# EAGLE design IO4-IR-Detector-Active-Fingers (EAGLE 7.7.0)
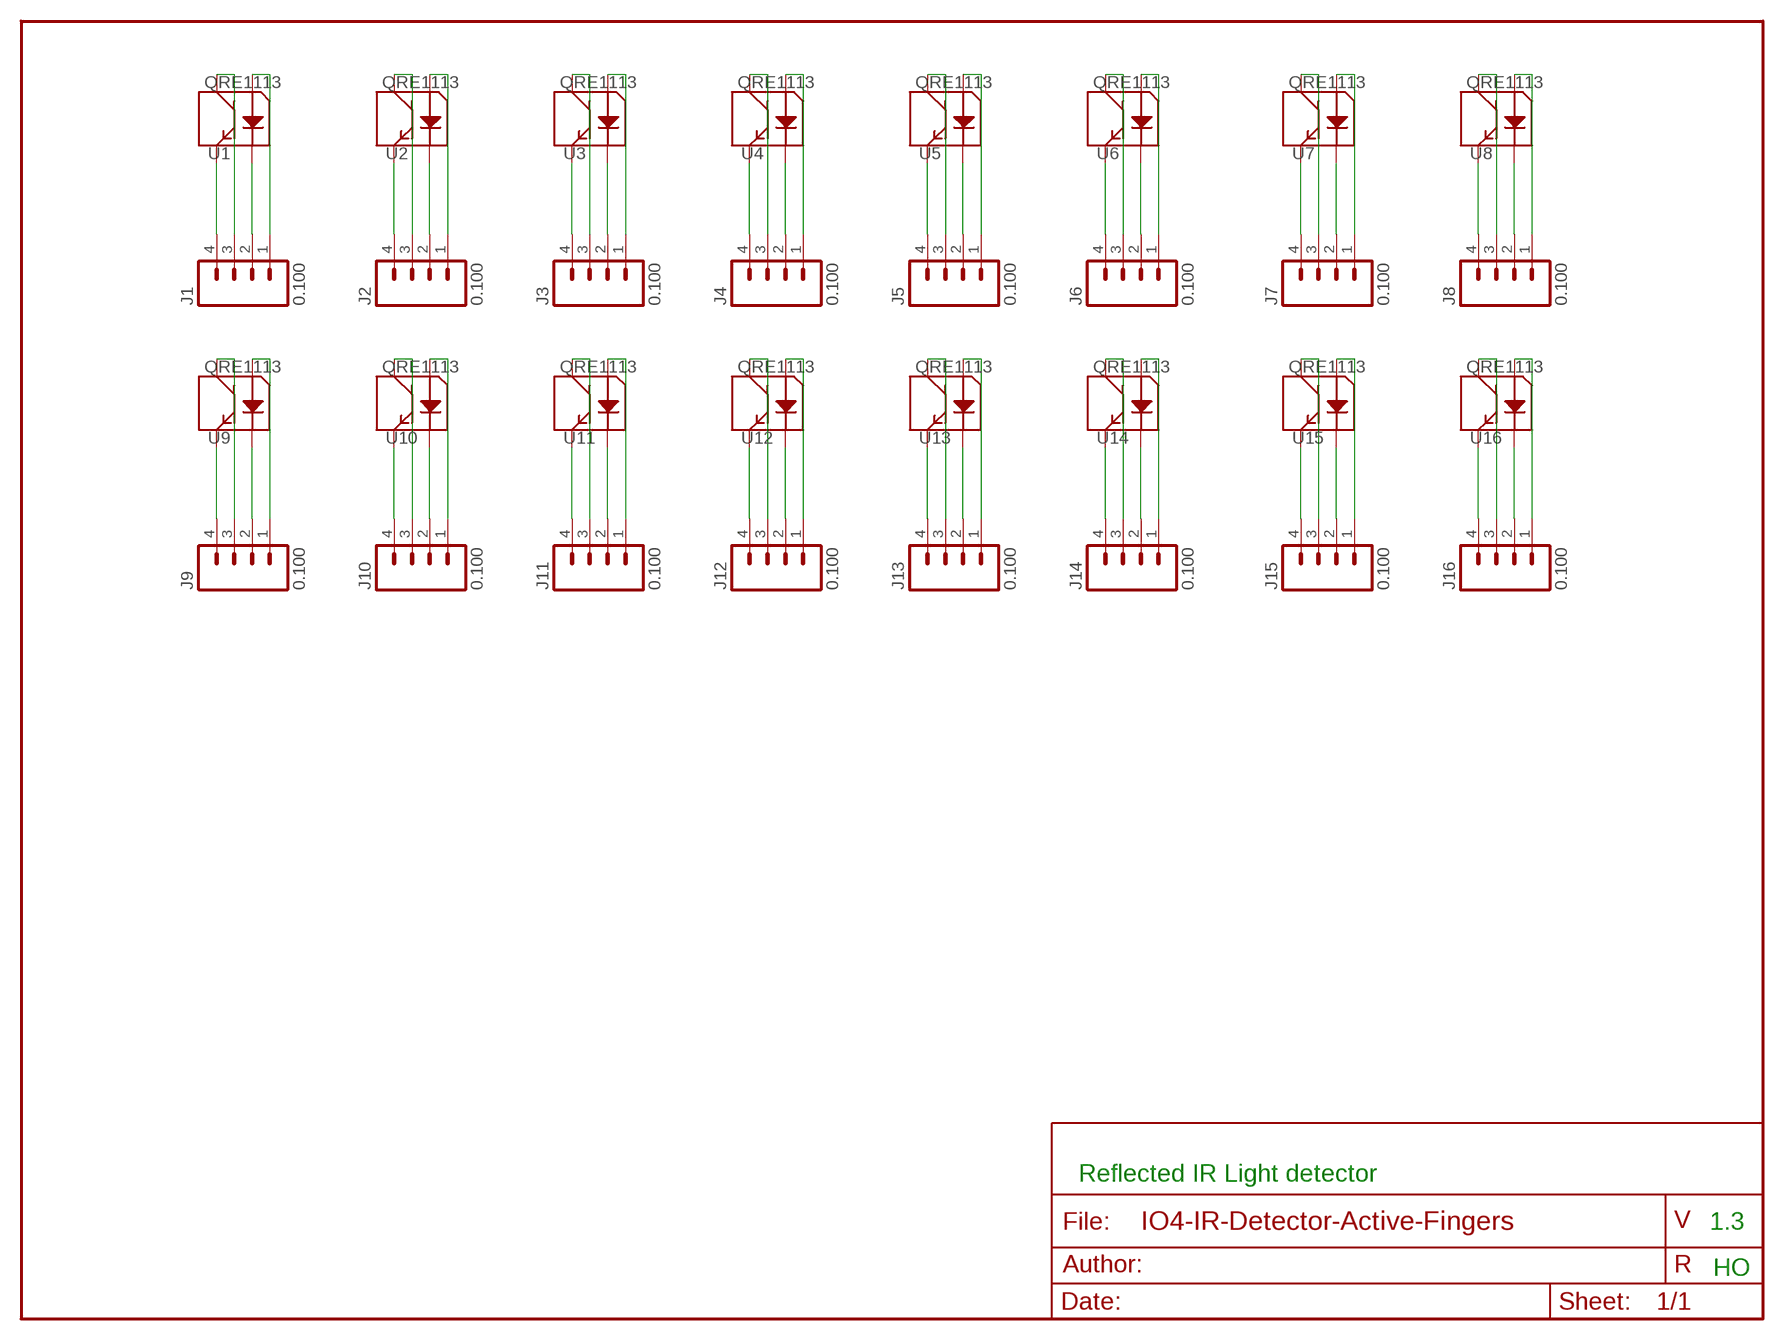
[diagram p0: schematic, sheet 1]

## Parts
J1  0.100  CONNECTOR-M04LOCK  [1X04_LOCK]
J2  0.100  CONNECTOR-M04LOCK  [1X04_LOCK]
J3  0.100  CONNECTOR-M04LOCK  [1X04_LOCK]
J4  0.100  CONNECTOR-M04LOCK  [1X04_LOCK]
J5  0.100  CONNECTOR-M04LOCK  [1X04_LOCK]
J6  0.100  CONNECTOR-M04LOCK  [1X04_LOCK]
J7  0.100  CONNECTOR-M04LOCK  [1X04_LOCK]
J8  0.100  CONNECTOR-M04LOCK  [1X04_LOCK]
J9  0.100  CONNECTOR-M04LOCK  [1X04_LOCK]
J10  0.100  CONNECTOR-M04LOCK  [1X04_LOCK]
J11  0.100  CONNECTOR-M04LOCK  [1X04_LOCK]
J12  0.100  CONNECTOR-M04LOCK  [1X04_LOCK]
J13  0.100  CONNECTOR-M04LOCK  [1X04_LOCK]
J14  0.100  CONNECTOR-M04LOCK  [1X04_LOCK]
J15  0.100  CONNECTOR-M04LOCK  [1X04_LOCK]
J16  0.100  CONNECTOR-M04LOCK  [1X04_LOCK]
U1  QRE1113  [QRE1113]
U2  QRE1113  [QRE1113]
U3  QRE1113  [QRE1113]
U4  QRE1113  [QRE1113]
U5  QRE1113  [QRE1113]
U6  QRE1113  [QRE1113]
U7  QRE1113  [QRE1113]
U8  QRE1113  [QRE1113]
U9  QRE1113  [QRE1113]
U10  QRE1113  [QRE1113]
U11  QRE1113  [QRE1113]
U12  QRE1113  [QRE1113]
U13  QRE1113  [QRE1113]
U14  QRE1113  [QRE1113]
U15  QRE1113  [QRE1113]
U16  QRE1113  [QRE1113]

## Nets
N$1: J1.4 U1.4(E)
N$2: J1.2 U1.2(K)
N$3: J1.1 U1.1(A)
N$4: J4.4 U4.4(E)
N$5: J4.2 U4.2(K)
N$6: J4.1 U4.1(A)
N$7: J1.3 U1.3(C)
N$8: J6.1 U6.1(A)
N$9: J7.1 U7.1(A)
N$10: J8.1 U8.1(A)
N$11: J9.1 U9.1(A)
N$12: J10.1 U10.1(A)
N$13: J11.1 U11.1(A)
N$14: J12.1 U12.1(A)
N$15: J13.1 U13.1(A)
N$16: J14.1 U14.1(A)
N$17: J15.1 U15.1(A)
N$18: J16.1 U16.1(A)
N$19: J2.4 U2.4(E)
N$20: J2.2 U2.2(K)
N$21: J2.1 U2.1(A)
N$22: J3.4 U3.4(E)
N$23: J3.2 U3.2(K)
N$24: J3.1 U3.1(A)
N$25: J2.3 U2.3(C)
N$26: J5.4 U5.4(E)
N$27: J5.2 U5.2(K)
N$28: J5.1 U5.1(A)
N$29: J6.4 U6.4(E)
N$30: J6.2 U6.2(K)
N$31: J3.3 U3.3(C)
N$32: J7.4 U7.4(E)
N$33: J7.2 U7.2(K)
N$34: J4.3 U4.3(C)
N$35: J8.4 U8.4(E)
N$36: J8.2 U8.2(K)
N$37: J5.3 U5.3(C)
N$38: J9.4 U9.4(E)
N$39: J9.2 U9.2(K)
N$40: J7.3 U7.3(C)
N$41: J8.3 U8.3(C)
N$42: J16.3 U16.3(C)
N$43: J15.3 U15.3(C)
N$44: J14.3 U14.3(C)
N$45: J10.4 U10.4(E)
N$46: J10.2 U10.2(K)
N$47: J13.3 U13.3(C)
N$48: J11.4 U11.4(E)
N$49: J11.2 U11.2(K)
N$50: J12.3 U12.3(C)
N$51: J12.4 U12.4(E)
N$52: J12.2 U12.2(K)
N$53: J13.4 U13.4(E)
N$54: J13.2 U13.2(K)
N$55: J11.3 U11.3(C)
N$56: J14.4 U14.4(E)
N$57: J14.2 U14.2(K)
N$58: J15.4 U15.4(E)
N$59: J15.2 U15.2(K)
N$60: J16.4 U16.4(E)
N$61: J16.2 U16.2(K)
N$62: J10.3 U10.3(C)
N$63: J9.3 U9.3(C)
N$64: J6.3 U6.3(C)

## Notes on the sheet
- Reflected IR Light detector
- 1.3
- HO

## Library data of the parts
J1-J16 = SPCoast:CONNECTOR-M04: Header 4 Standard 4-pin 0.1" header. Use with straight break away headers (SKU : PRT-00116), right angle break away headers (PRT-00553), swiss pins (PRT-00743), machine pins (PRT-00117), and female headers (PRT-00115). Molex polarized connector foot print use with SKU : PRT-08231 with associated crimp pins and housings. 1MM SMD Version SKU: PRT-10208
U1-U16 = SPCoast:QRE1113: Reflective object sensor; PROD_ID: IC-09357

## Board
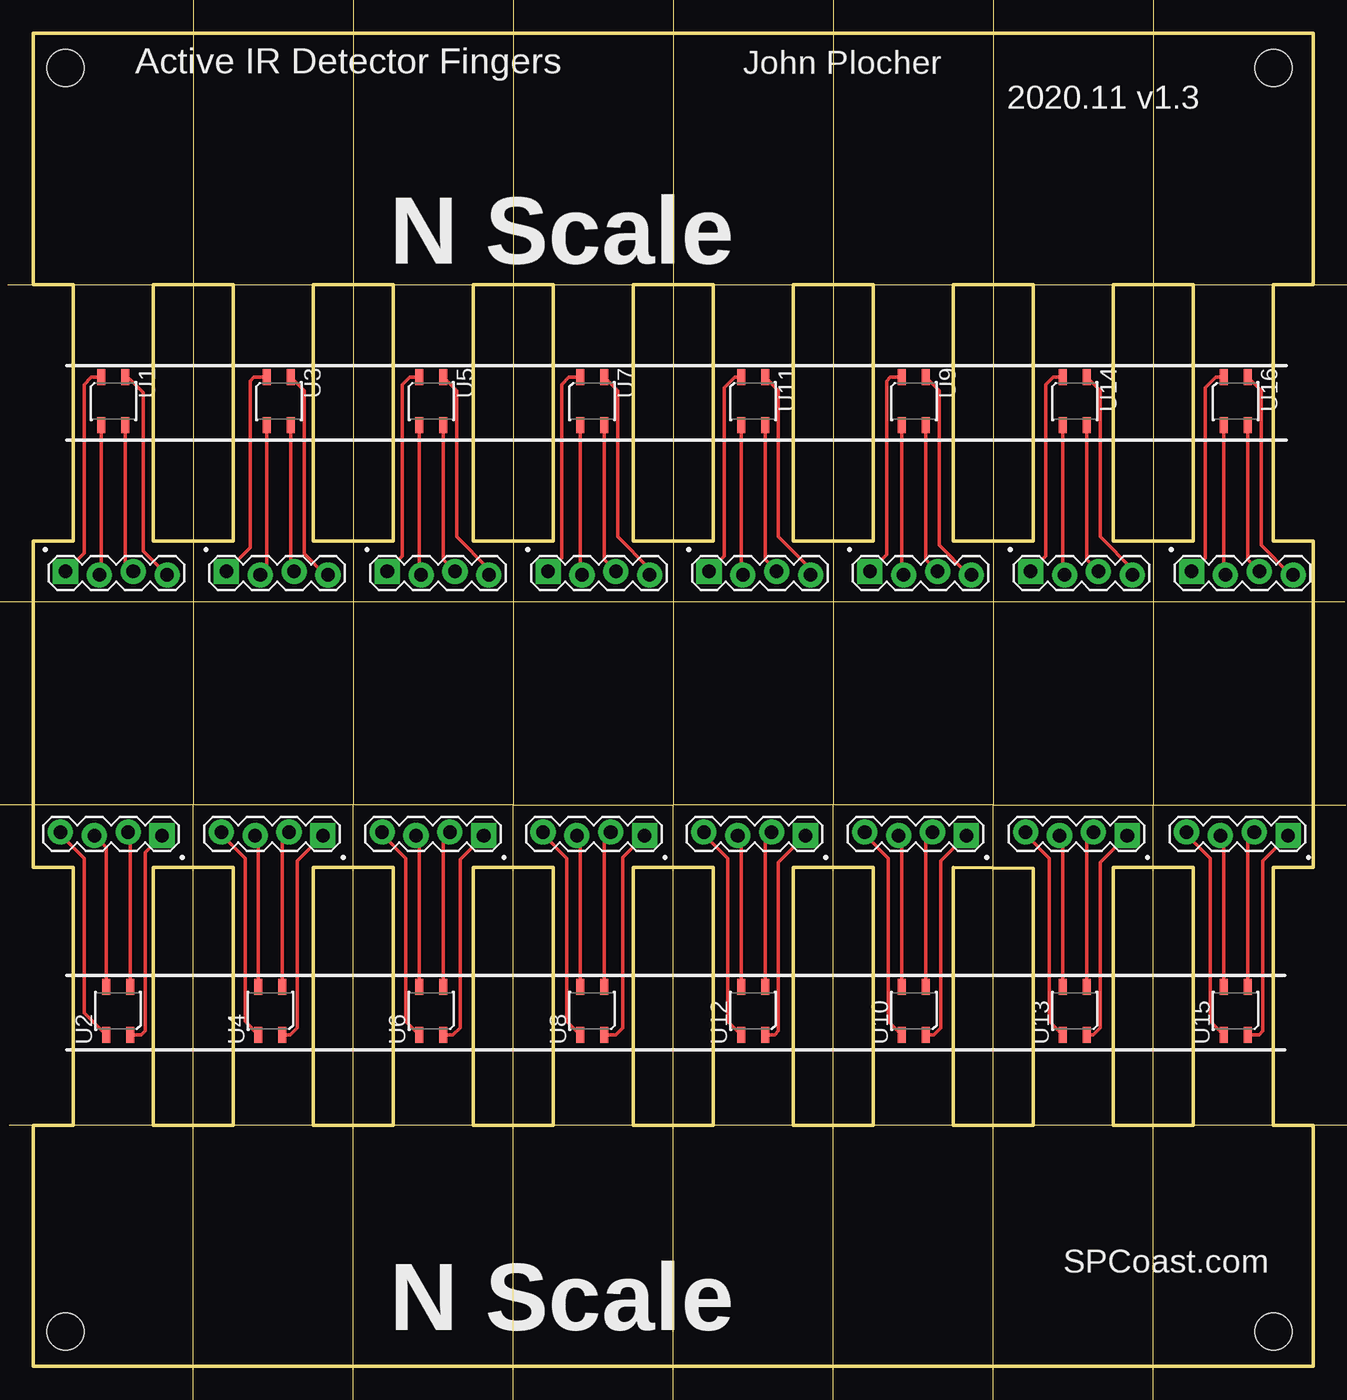
[diagram p1: board, top side]
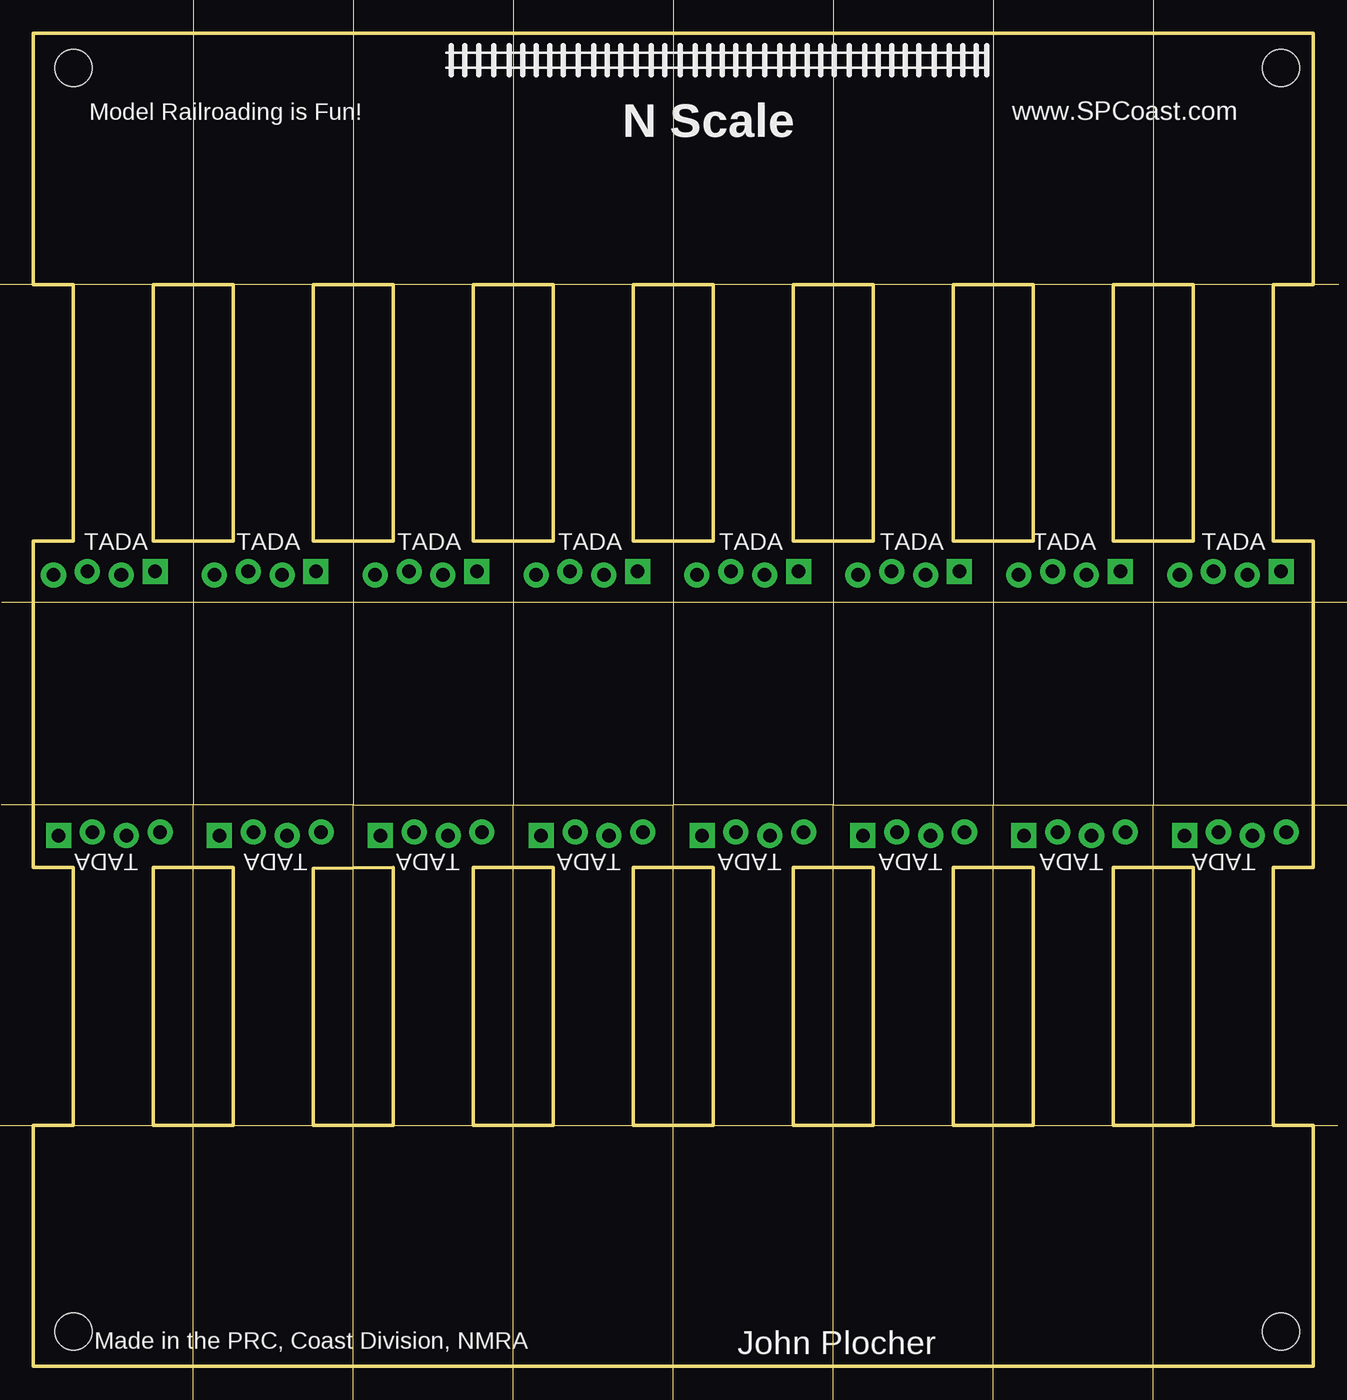
[diagram p2: board, bottom side, seen from below]

Size 96 x 100 mm. Coordinates in mm from the lower left corner, seen from the top.
Outline: 9,61.91 9,81.15 15,81.15 15,61.91 9,61.91
Outline: 3,81.15 3,61.91 0,61.91 0,37.4 3,37.4 3,18.09 0,18.09 0,0 96,0 96,18.09 93,18.09 93,37.4 96,37.4 96,61.91 93,61.91 93,81.15 96,81.15 96,100 0,100 0,81.15 3,81.15
Outline: 9,18.09 9,37.4 15,37.4 15,18.09 9,18.09
Outline: 21,61.91 21,81.15 27,81.15 27,61.91 21,61.91
Outline: 21,18.09 21,37.4 27,37.4 27,18.09 21,18.09
Outline: 33,61.91 33,81.15 39,81.15 39,61.91 33,61.91
Outline: 33,18.09 33,37.4 39,37.4 39,18.09 33,18.09
Outline: 45,18.09 45,37.4 51,37.4 51,18.09 45,18.09
Outline: 45,61.91 45,81.15 51,81.15 51,61.91 45,61.91
Outline: 69,61.91 69,81.15 75,81.15 75,61.91 69,61.91
Outline: 63,81.15 63,61.91 57,61.91 57,81.15 63,81.15
Outline: 63,37.4 63,18.09 57,18.09 57,37.4 63,37.4
Outline: 69,18.09 69,37.4 75,37.34 75,18.09 69,18.09
Outline: 81,18.09 81,37.4 87,37.4 87,18.09 81,18.09
Outline: 81,61.91 81,81.15 87,81.15 87,61.91 81,61.91
Copper layers (1*16): Top 0.035mm / dielectric 1.5mm / Bottom 0.035mm
Design rules "default *": minimum track width 10mil, minimum drill 0.6mm, track to track 8mil, track to pad 8mil, pad to pad 8mil, via to via 8mil, smd to smd 8mil, copper to edge 8mil, drill to drill 8mil, minimum pad ring 10mil, minimum via ring 8mil, stop-mask expansion 4mil, vias tented up to drill 0mil, thermal gap 10mil
Holes 2.8 mm at 2.41,97.41 93,97.41 93,2.59 2.41,2.59
Milling: 25 lines

### Footprints (pad centres in the part's own frame; a part is rotated, then mirrored left to right if it is on the bottom)
1X04_LOCK = drill 1.016 pad 1.88 square: 1 0,0.127 | drill 1.016 pad 1.88: 2 2.54,-0.127; 3 5.08,0.127; 4 7.62,-0.127
QRE1113 = smd 1.2 x 0.6: 1 -1.8,-0.9; 2 1.8,-0.9; 3 1.8,0.9; 4 -1.8,0.9

### Placement (x,y rotation side)
J1  2.41,59.5 0 top
J2  9.65,39.94 180 top
J3  14.48,59.5 0 top
J4  21.72,39.94 180 top
J5  26.54,59.5 0 top
J6  33.78,39.94 180 top
J7  38.61,59.5 0 top
J8  45.85,39.94 180 top
J9  62.74,59.5 0 top
J10  69.98,39.94 180 top
J11  50.67,59.5 0 top
J12  57.91,39.94 180 top
J13  82.04,39.94 180 top
J14  74.8,59.5 0 top
J15  94.11,39.94 180 top
J16  86.87,59.5 0 top
U1  6,72.39 270 top
U2  6.35,26.67 90 top
U3  18.41,72.39 270 top
U4  17.78,26.67 90 top
U5  29.84,72.39 270 top
U6  29.84,26.67 90 top
U7  41.91,72.39 270 top
U8  41.91,26.67 90 top
U9  66.04,72.39 270 top
U10  66.04,26.67 90 top
U11  53.98,72.39 270 top
U12  53.98,26.67 90 top
U13  78.11,26.67 90 top
U14  78.11,72.39 270 top
U15  90.17,26.67 90 top
U16  90.17,72.39 270 top

### Tracks (layer width: path | path; a pad name or v marks a point on that pad's centre or on a via)
N$1
  Top 0.254: U1.4 7.25,74.03 8.26,73.03 8.26,61.15 J1.4
N$2
  Top 0.254: U1.2 5.1,59.52 J1.2
N$3
  Top 0.254: U1.1 4.34,74.19 3.81,73.66 3.81,61.02 J1.1
N$4
  Top 0.254: U4.4 15.88,25.88 15.88,38.1 14.1,39.88 J4.4
N$5
  Top 0.254: U4.2 18.68,39.57 J4.2
N$6
  Top 0.254: U4.1 19.28,24.87 19.81,25.4 19.81,37.91 J4.1
N$7
  Top 0.254: U1.3 6.9,60.22 J1.3
N$8
  Top 0.254: U6.1 31.47,24.87 32,25.4 32,38.04 J6.1
N$9
  Top 0.254: U7.1 40.15,74.19 39.62,73.66 39.62,60.64 J7.1
N$10
  Top 0.254: U8.1 43.67,24.87 44.2,25.4 44.2,38.16 J8.1
N$11
  Top 0.254: U9.1 64.28,74.19 64.01,73.91 64.01,60.9 J9.1
N$12
  Top 0.254: U10.1 67.54,24.87 68.07,25.4 68.07,37.91 J10.1
N$13
  Top 0.254: U11.1 52.6,74.19 51.82,73.41 51.82,60.77 J11.1
N$14
  Top 0.254: U12.1 55.6,24.87 55.88,25.15 55.88,37.78 J12.1
N$15
  Top 0.254: U13.1 79.48,24.87 80.01,25.4 80.01,37.78 J13.1
N$16
  Top 0.254: U14.1 76.48,74.19 75.95,73.66 75.95,60.77 J14.1
N$17
  Top 0.254: U15.1 91.93,24.87 92.2,25.15 92.2,37.91 J15.1
N$18
  Top 0.254: U16.1 88.67,74.19 87.88,73.41 87.88,60.64 J16.1
N$19
  Top 0.254: U2.4 3.81,26.51 3.81,38.1 2.03,39.88 J2.4
N$20
  Top 0.254: U2.2 7.25,39.93 J2.2
N$21
  Top 0.254: U2.1 8.11,24.87 8.38,25.15 8.38,38.54 J2.1
N$22
  Top 0.254: U3.4 20.32,73.19 20.32,60.96 21.91,59.37 J3.4
N$23
  Top 0.254: U3.2 17.52,59.87 J3.2
N$24
  Top 0.254: U3.1 16.53,74.19 16.26,73.91 16.26,61.4 J3.1
N$25
  Top 0.254: U2.3 5.45,38.94 J2.3
N$26
  Top 0.254: U5.4 31.75,73.19 31.75,62.23 34.16,59.82 J5.4
N$27
  Top 0.254: U5.2 28.95,59.51 J5.2
N$28
  Top 0.254: U5.1 28.22,74.19 27.69,73.66 27.69,60.77 J5.1
N$29
  Top 0.254: U6.4 27.94,25.88 27.94,38.1 26.16,39.88 J6.4
N$30
  Top 0.254: U6.2 30.75,39.57 J6.2
N$31
  Top 0.254: U3.3 19.32,59.87 J3.3
N$32
  Top 0.254: U7.4 43.81,73.19 43.81,62.23 46.23,59.82 J7.4
N$33
  Top 0.254: U7.2 41.01,59.51 J7.2
N$34
  Top 0.254: U4.3 16.88,39.57 J4.3
N$35
  Top 0.254: U8.4 40.01,25.88 40.01,38.1 38.23,39.88 J8.4
N$36
  Top 0.254: U8.2 42.81,39.57 J8.2
N$37
  Top 0.254: U5.3 30.75,60.5 J5.3
N$38
  Top 0.254: U9.4 67.94,73.19 67.94,61.59 70.17,59.37 J9.4
N$39
  Top 0.254: U9.2 65.14,59.51 J9.2
N$40
  Top 0.254: U7.3 42.81,60.5 J7.3
N$41
  Top 0.254: U8.3 41.01,39.57 J8.3
N$42
  Top 0.254: U16.3 91.07,60.5 J16.3
N$43
  Top 0.254: U15.3 89.27,39.57 J15.3
N$44
  Top 0.254: U14.3 79,60.5 J14.3
N$45
  Top 0.254: U10.4 64.14,25.88 64.14,38.1 62.36,39.88 J10.4
N$46
  Top 0.254: U10.2 66.94,39.57 J10.2
N$47
  Top 0.254: U13.3 77.2,39.57 J13.3
N$48
  Top 0.254: U11.4 55.88,73.19 55.88,62.23 58.29,59.82 J11.4
N$49
  Top 0.254: U11.2 53.08,59.51 J11.2
N$50
  Top 0.254: U12.3 53.08,39.57 J12.3
N$51
  Top 0.254: U12.4 52.07,25.88 52.07,38.1 50.29,39.88 J12.4
N$52
  Top 0.254: U12.2 54.88,39.57 J12.2
N$53
  Top 0.254: U13.4 76.2,25.88 76.2,38.1 74.42,39.88 J13.4
N$54
  Top 0.254: U13.2 79,39.57 J13.2
N$55
  Top 0.254: U11.3 54.88,60.5 J11.3
N$56
  Top 0.254: U14.4 80.01,73.19 80.01,62.23 82.42,59.82 J14.4
N$57
  Top 0.254: U14.2 77.2,59.51 J14.2
N$58
  Top 0.254: U15.4 88.27,25.88 88.27,38.1 86.49,39.88 J15.4
N$59
  Top 0.254: U15.2 91.07,39.57 J15.2
N$60
  Top 0.254: U16.4 92.08,73.19 92.08,61.59 94.3,59.37 J16.4
N$61
  Top 0.254: U16.2 89.27,59.51 J16.2
N$62
  Top 0.254: U10.3 65.14,39.57 J10.3
N$63
  Top 0.254: U9.3 66.94,60.5 J9.3
N$64
  Top 0.254: U6.3 28.95,39.57 J6.3

### Text on the board
tPlace: Active IR Detector Fingers | John Plocher | 2020.11 v1.3 | N Scale | SPCoast.com | N Scale
bPlace: www.SPCoast.com | Model Railroading is Fun! | N Scale | TADA | TADA | TADA | TADA | TADA | TADA | TADA | TADA | TADA | TADA | TADA | TADA | TADA | TADA | TADA | TADA | John Plocher | Made in the PRC, Coast Division, NMRA
Milling: V-SCORE | V-SCORE | V-SCORE | V-SCORE | V-SCORE | V-SCORE | V-SCORE | V-SCORE | V-SCORE | V-SCORE | V-SCORE